# Altium schematic sheet mcu_imu.schdoc: MCU and IMU
size 431 x 279 mm; DrawnBy: D. Bruey, M.Ciuffo; Organization: Synapse Product Development, LLC.; Address1: 1511 6th Ave., Suite 400; Address2: Seattle, Washington 98101; Address3: 206.381.0898; Address4: www.synapse.com; DocumentNumber: 7; SheetNumber: 5; SheetTotal: 10; PageSetup: Record=PageOptions|CenterHorizontal=True|CenterVertical=True|PrintScale=0.96|XCorrection=1.00|YCorrection=1.00|PrintKind=1|BorderSize=5000000|LeftOffset=0|BottomOffset=0|Orientation=2|PaperLength=4318|PaperWidth=2794|Scale=100|PaperSource=7|PrintQuality=200|MediaType=1|DitherType=10|PrintScaleMode=1|PaperKind=11x17|PaperIndex=3
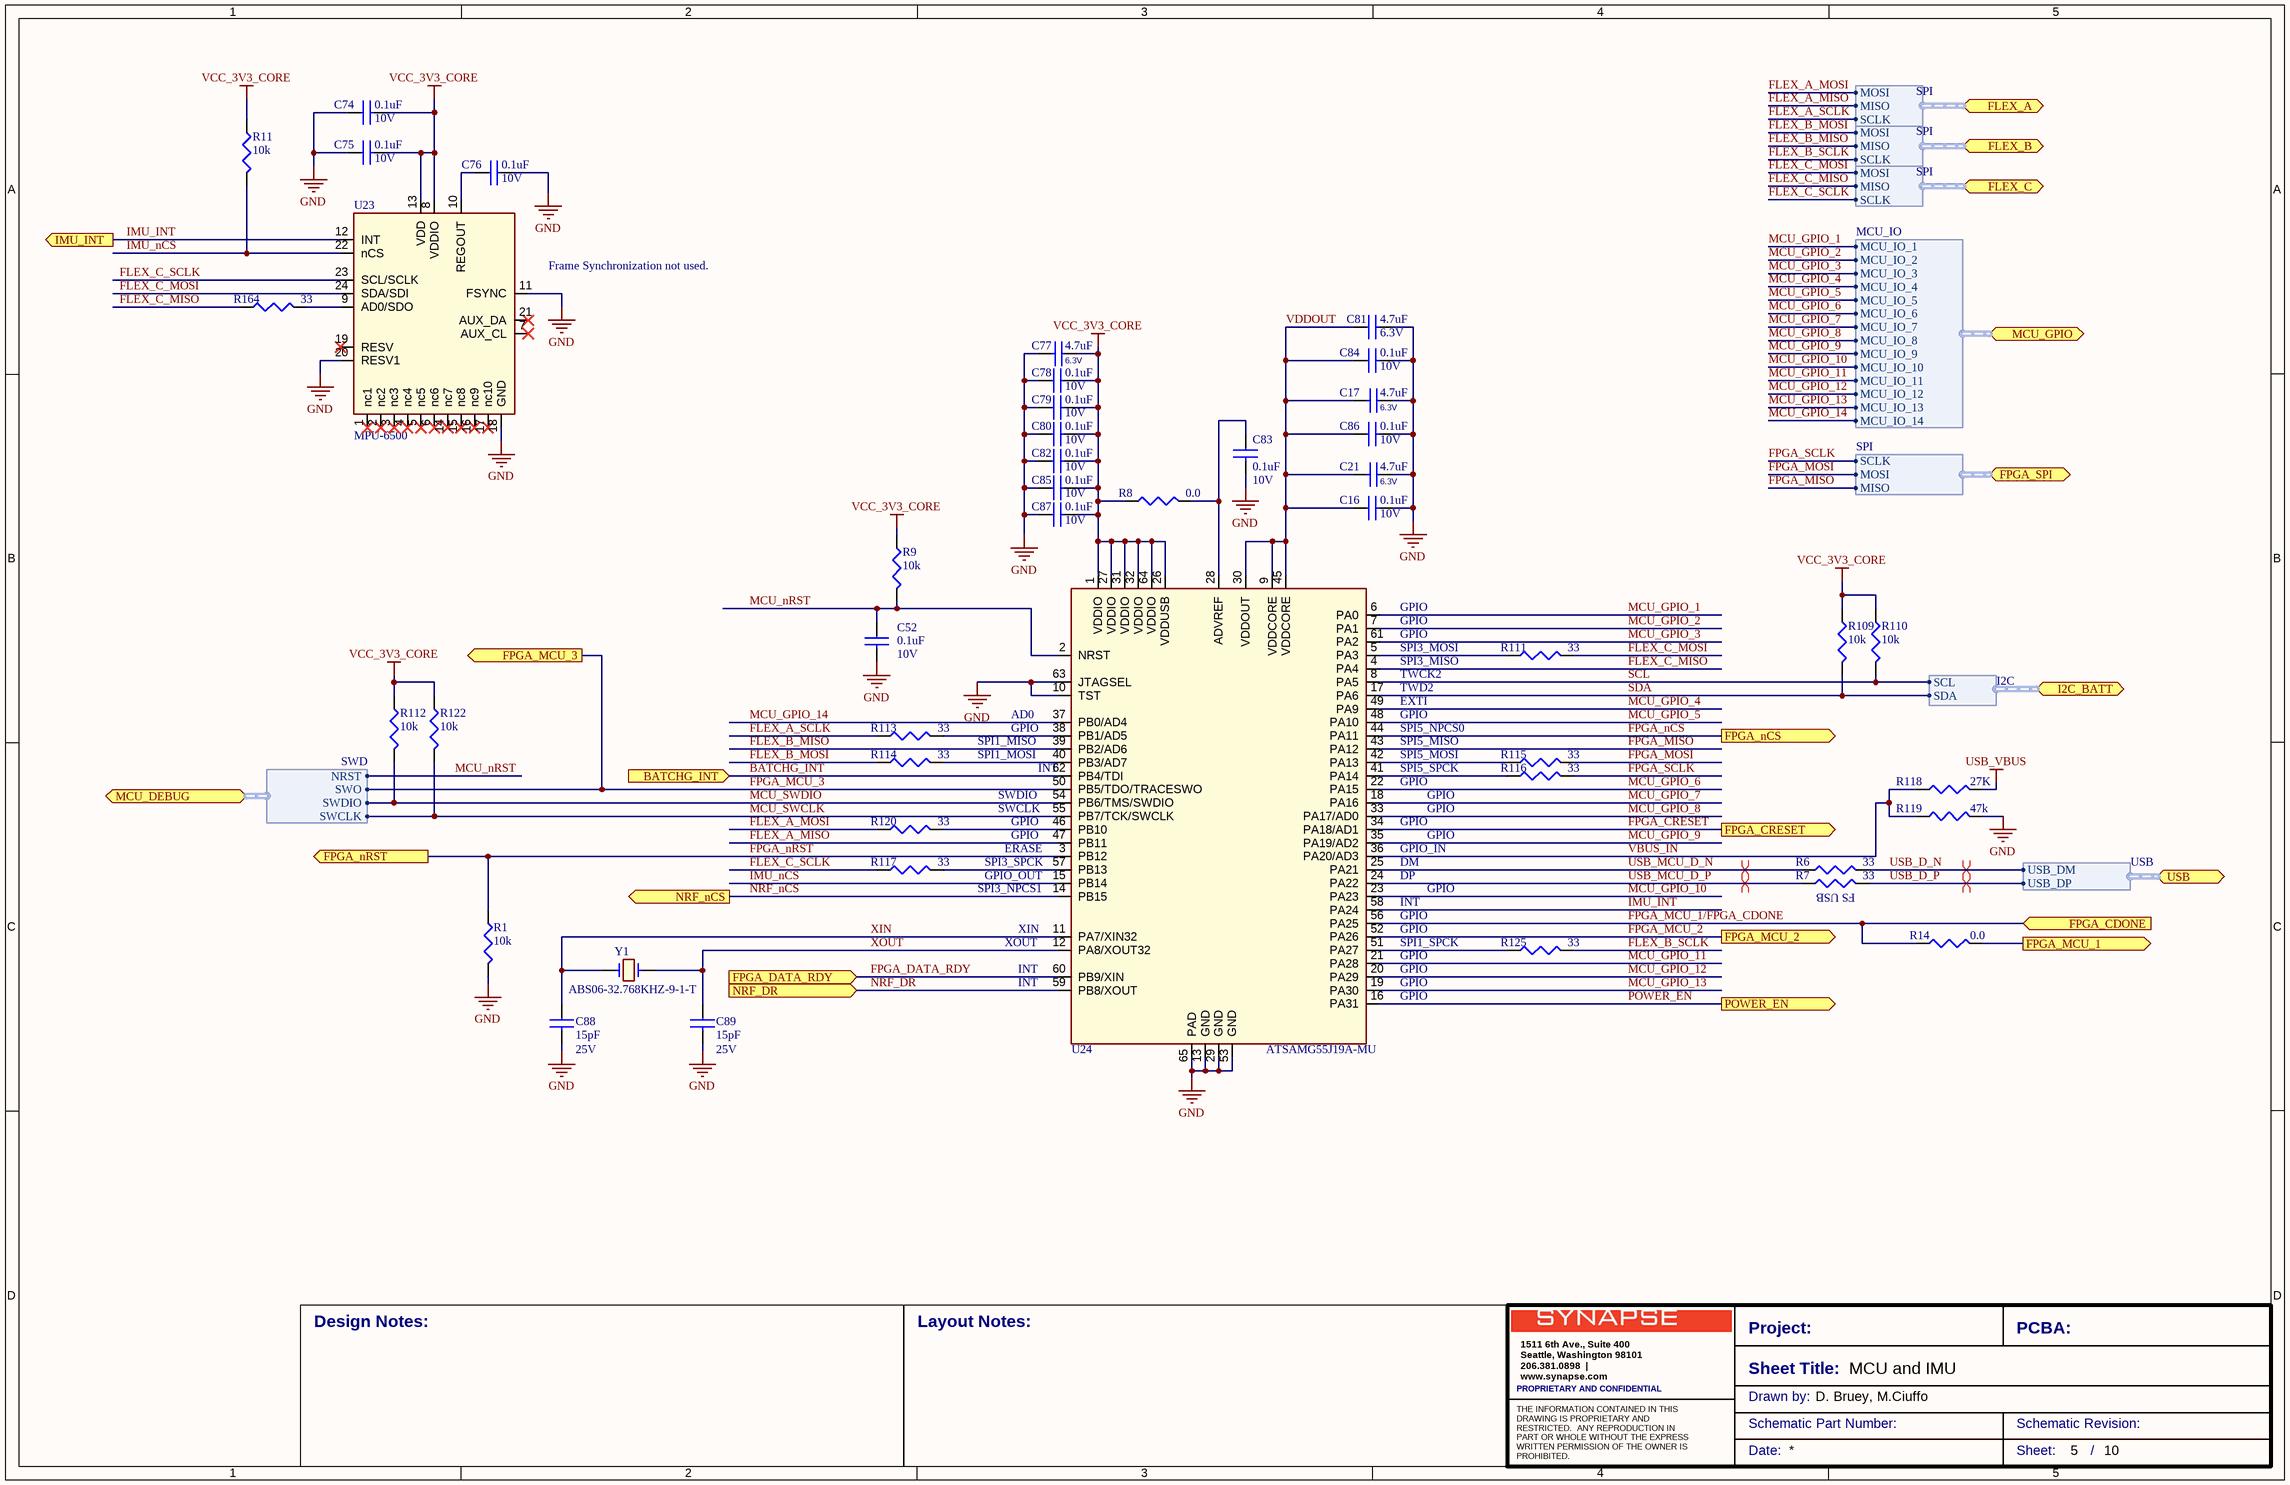
[diagram p0: mcu_imu.schdoc]

## Parts
C16  0.1uF  Voltage: 10V  [0201-IPCsm_33]
C17  4.7uF  Voltage: 6.3V  [0402-IPCsm_55]
C21  4.7uF  Voltage: 6.3V  [0402-IPCsm_55]
C52  0.1uF  Voltage: 10V  [0201-IPCsm_33]
C74  0.1uF  Voltage: 10V  [0201-IPCsm_33]
C75  0.1uF  Voltage: 10V  [0201-IPCsm_33]
C76  0.1uF  Voltage: 10V  [0201-IPCsm_33]
C77  4.7uF  Voltage: 6.3V  [0402-IPCsm_55]
C78  0.1uF  Voltage: 10V  [0201-IPCsm_33]
C79  0.1uF  Voltage: 10V  [0201-IPCsm_33]
C80  0.1uF  Voltage: 10V  [0201-IPCsm_33]
C81  4.7uF  Voltage: 6.3V  [0402-IPCsm_55]
C82  0.1uF  Voltage: 10V  [0201-IPCsm_33]
C83  0.1uF  Voltage: 10V  [0201-IPCsm_33]
C84  0.1uF  Voltage: 10V  [0201-IPCsm_33]
C85  0.1uF  Voltage: 10V  [0201-IPCsm_33]
C86  0.1uF  Voltage: 10V  [0201-IPCsm_33]
C87  0.1uF  Voltage: 10V  [0201-IPCsm_33]
C88  15pF  Voltage: 25V  [0201-IPCsm_33]
C89  15pF  Voltage: 25V  [0201-IPCsm_33]
R1  10k  [0201-IPCsm_26]
R6  33  [0201-IPCsm_26]
R7  33  [0201-IPCsm_26]
R8  0.0  [0201-IPCsm_26]
R9  10k  [0201-IPCsm_26]
R11  10k  [0201-IPCsm_26]
R14  0.0  [0201-IPCsm_26]
R109  10k  [0201-IPCsm_26]
R110  10k  [0201-IPCsm_26]
R111  33  [0201-IPCsm_26]
R112  10k  [0201-IPCsm_26]
R113  33  [0201-IPCsm_26]
R114  33  [0201-IPCsm_26]
R115  33  [0201-IPCsm_26]
R116  33  [0201-IPCsm_26]
R117  33  [0201-IPCsm_26]
R118  27K  [0201-IPCsm_26]
R119  47k  [0201-IPCsm_26]
R120  33  [0201-IPCsm_26]
R122  10k  [0201-IPCsm_26]
R125  33  [0201-IPCsm_26]
R164  33  [0201-IPCsm_26]
U23  MPU-6500  [QFN24_mpu-6500_3x3]
U24  ATSAMG55J19A-MU  [qfn64_atsamg55j19a_no_vias]
Y1  ABS06-32.768KHZ-9-1-T  [xtal_abs06]

## Ports
BATCHG_INT (in), FLEX_A (harness SPI), FLEX_B (harness SPI), FLEX_C (harness SPI), FPGA_CDONE (in), FPGA_CRESET (out), FPGA_DATA_RDY (in), FPGA_MCU_1 (out), FPGA_MCU_2 (out), FPGA_MCU_3 (out), FPGA_nCS (out), FPGA_nRST (out), FPGA_SPI (harness SPI), I2C_BATT (harness I2C), IMU_INT (out), MCU_DEBUG (harness SWD), MCU_GPIO (harness MCU_IO), NRF_DR (in), NRF_nCS (out), POWER_EN (out), USB (harness USB)

## Harnesses
SWD: NRST, SWCLK, SWDIO, SWO
USB: USB_DM, USB_DP
I2C: SDA, SCL
MCU_IO: MCU_IO_1, MCU_IO_2, MCU_IO_3, MCU_IO_4, MCU_IO_5, MCU_IO_6, MCU_IO_7, MCU_IO_8, MCU_IO_9, MCU_IO_10, MCU_IO_11, MCU_IO_12, MCU_IO_13, MCU_IO_14
SPI: MOSI, MISO, SCLK

## Nets
GND: C16.2 C17.1 C21.1 C52.2 C74.1 C75.1 C76.2 C77.2 C78.1 C79.1 C80.1 C81.2 C82.1 C83.2 C84.2 C85.1 C86.2 C87.1 C88.2 C89.2 R1.2 R119.2 U23.11(FSYNC) U23.18(GND) U23.20(RESV1) U24.10(TST) U24.13(GND) U24.29(GND) U24.53(GND) U24.63(JTAGSEL) U24.65(PAD)
USB_VBUS: R118.2
VCC_3V3_CORE: C74.2 C75.2 C77.1 C78.2 C79.2 C80.2 C82.2 C85.2 C87.2 R8.1 R9.1 R11.1 R109.1 R110.1 R112.1 R122.1 U23.8(VDDIO) U23.13(VDD) U24.1(VDDIO) U24.26(VDDUSB) U24.27(VDDIO) U24.31(VDDIO) U24.32(VDDIO) U24.64(VDDIO)
BATCHG_INT: U24.62(PB4/TDI) ; port BATCHG_INT
FLEX_A_MISO: U24.47(PB11) ; port FLEX_A.MISO
FLEX_A_MOSI: R120.1 ; port FLEX_A.MOSI
FLEX_A_SCLK: R113.1 ; port FLEX_A.SCLK
FLEX_B_MISO: U24.39(PB2/AD6) ; port FLEX_B.MISO
FLEX_B_MOSI: R114.1 ; port FLEX_B.MOSI
FLEX_B_SCLK: R125.2 ; port FLEX_B.SCLK
FLEX_C_MISO: R164.1 U24.4(PA4) ; port FLEX_C.MISO
FLEX_C_MOSI: R111.2 U23.24(SDA/SDI) ; port FLEX_C.MOSI
FLEX_C_SCLK: R117.1 U23.23(SCL/SCLK) ; port FLEX_C.SCLK
FPGA_CRESET: U24.34(PA18/AD1) ; port FPGA_CRESET
FPGA_DATA_RDY: U24.60(PB9/XIN) ; port FPGA_DATA_RDY
FPGA_MCU_1: R14.1 ; port FPGA_MCU_1
FPGA_MCU_1/FPGA_CDONE: R14.2 U24.56(PA25) ; port FPGA_CDONE
FPGA_MCU_2: U24.52(PA26) ; port FPGA_MCU_2
FPGA_MCU_3: U24.50(PB5/TDO/TRACESWO) ; port FPGA_MCU_3, port MCU_DEBUG.SWO
FPGA_MISO: U24.43(PA12) ; port FPGA_SPI.MISO
FPGA_MOSI: R115.2 ; port FPGA_SPI.MOSI
FPGA_nCS: U24.44(PA11) ; port FPGA_nCS
FPGA_nRST: R1.1 U24.3(PB12) ; port FPGA_nRST
FPGA_SCLK: R116.2 ; port FPGA_SPI.SCLK
IMU_INT: U23.12(INT) U24.58(PA24) ; port IMU_INT
IMU_nCS: R11.2 U23.22(nCS) U24.15(PB14)
MCU_GPIO_1: U24.6(PA0) ; port MCU_GPIO.MCU_IO_1
MCU_GPIO_2: U24.7(PA1) ; port MCU_GPIO.MCU_IO_2
MCU_GPIO_3: U24.61(PA2) ; port MCU_GPIO.MCU_IO_3
MCU_GPIO_4: U24.49(PA9) ; port MCU_GPIO.MCU_IO_4
MCU_GPIO_5: U24.48(PA10) ; port MCU_GPIO.MCU_IO_5
MCU_GPIO_6: U24.22(PA15) ; port MCU_GPIO.MCU_IO_6
MCU_GPIO_7: U24.18(PA16) ; port MCU_GPIO.MCU_IO_7
MCU_GPIO_8: U24.33(PA17/AD0) ; port MCU_GPIO.MCU_IO_8
MCU_GPIO_9: U24.35(PA19/AD2) ; port MCU_GPIO.MCU_IO_9
MCU_GPIO_10: U24.23(PA23) ; port MCU_GPIO.MCU_IO_10
MCU_GPIO_11: U24.21(PA28) ; port MCU_GPIO.MCU_IO_11
MCU_GPIO_12: U24.20(PA29) ; port MCU_GPIO.MCU_IO_12
MCU_GPIO_13: U24.19(PA30) ; port MCU_GPIO.MCU_IO_13
MCU_GPIO_14: U24.37(PB0/AD4) ; port MCU_GPIO.MCU_IO_14
MCU_nRST: C52.1 R9.2 U24.2(NRST) ; port MCU_DEBUG.NRST
MCU_SWCLK: R122.2 U24.55(PB7/TCK/SWCLK) ; port MCU_DEBUG.SWCLK
MCU_SWDIO: R112.2 U24.54(PB6/TMS/SWDIO) ; port MCU_DEBUG.SWDIO
NRF_DR: U24.59(PB8/XOUT) ; port NRF_DR
NRF_nCS: U24.14(PB15) ; port NRF_nCS
POWER_EN: U24.16(PA31) ; port POWER_EN
SCL: R110.2 U24.8(PA5) ; port I2C_BATT.SCL
SDA: R109.2 U24.17(PA6) ; port I2C_BATT.SDA
USB_D_N: R6.2 ; port USB.USB_DM
USB_D_P: R7.2 ; port USB.USB_DP
USB_MCU_D_N: R6.1 U24.25(PA21)
USB_MCU_D_P: R7.1 U24.24(PA22)
VBUS_IN: R118.1 R119.1 U24.36(PA20/AD3)
VDDOUT: C16.1 C17.2 C21.2 C81.1 C84.1 C86.1 U24.9(VDDCORE) U24.30(VDDOUT) U24.45(VDDCORE)
XIN: C88.1 U24.11(PA7/XIN32) Y1.1
XOUT: C89.1 U24.12(PA8/XOUT32) Y1.2
NetC76_1: C76.1 U23.10(REGOUT)
NetC83_1: C83.1 R8.2 U24.28(ADVREF)
NetR111_1: R111.1 U24.5(PA3)
NetR113_2: R113.2 U24.38(PB1/AD5)
NetR114_2: R114.2 U24.40(PB3/AD7)
NetR115_1: R115.1 U24.42(PA13)
NetR116_1: R116.1 U24.41(PA14)
NetR117_2: R117.2 U24.57(PB13)
NetR120_2: R120.2 U24.46(PB10)
NetR125_1: R125.1 U24.51(PA27)
NetR164_2: R164.2 U23.9(AD0/SDO)

Not connected (* = marked no-connect by the designer): U23 1(nc1)* 2(nc2)* 3(nc3)* 4(nc4)* 5(nc5)* 6(nc6)* 7(AUX_CL)* 14(nc7)* 15(nc8)* 16(nc9)* 17(nc10)* 19(RESV)* 21(AUX_DA)*

## Layout directives
differential pair: USB_D_N, USB_D_P, USB_MCU_D_N, USB_MCU_D_P

## Notes on the sheet
- (near U23) Frame Synchronization not used.
- (near U24) GPIO
- (near U24) TWD2
- (near U24) EXTI
- (near U24) TWCK2
- (near U24) SPI3_MISO
- (near U24) SPI3_MOSI
- SPI1_MISO
- SPI1_MOSI
- (near U24) AD0
- (near U24) SPI5_MISO
- (near U24) SPI5_MOSI
- (near U24) SPI5_NPCS0
- (near U24) SWDIO
- SWCLK
- (near U24) INT
- (near U24) SPI5_SPCK
- SPI3_NPCS1
- (near U24) SPI3_SPCK
- GPIO_OUT
- (near U24) ERASE
- (near U24) DM
- (near U24) DP
- (near U24) GPIO_IN
- (near R7) FS USB
- (near U24) XOUT
- (near U24) XIN
- (near U24) SPI1_SPCK
- Design Notes:
- Layout Notes:
- Project:
- Sheet Title:
- PCBA:
- PROPRIETARY AND CONFIDENTIAL
- Drawn by:
- Schematic Part Number:
- Schematic Revision:
- Date:
- Sheet:
- /

## Library data of the parts
C16 C52 C74-C76 C78-C80 C82-C87 = CL03A104KP3NNNC: CAP CER 0.1UF 10V 10% X5R 0201; part_type: capacitor; id: 1260; mfg: Samsung Electro-Mechanics America, Inc; dist: DIGIKEY; dist_pn: 1276-1115-2-ND; source_package: C_1U_10V_X5R_0201; TableName: viewAltiumCapacitors; mfg_pn: CL03A104KP3NNNC; type: X5R; tolerance: 10%; height: 0.33mm; status: Unknown
C17 C21 C77 = GRM155R60J475ME47D: CAP CER 4.7UF 6.3V 20% X5R 0402; part_type: capacitor; id: 855; mfg: MURATA; dist: DIGIKEY; dist_pn: 490-5915-1-ND; symbol: \\SYNAPSEDEV.COM\DFS\FS\EE_STUFF\CAD_LIB\MASTER\MASTER_DISCRETE\CAP; allegro_footprint: 0402-IPCsm_55,c-0402_22H; source_package: C_4P7U_6.3V_X5R_0402; OrCADSymbol: MASTER_DISCRETE\CAP; TableName: viewAltiumCapacitors; mfg_pn: GRM155R60J475ME47D; type: X5R; tolerance: 20%; height: 0.55MM; status: Unknown; SymbolPath: C:\EE-Vault\Libraries\Schematic\MASTER_DISCRETE\CAP
C81 = GRM155R60J475ME47D: CAP CER 4.7UF 6.3V 20% X5R 0402; part_type: capacitor; id: 855; mfg: MURATA; dist: DIGIKEY; dist_pn: 490-5915-1-ND; source_package: C_4P7U_6.3V_X5R_0402; TableName: viewAltiumCapacitors; mfg_pn: GRM155R60J475ME47D; type: X5R; tolerance: 20%; height: 0.55MM; status: Unknown
C88 C89 = GRM0335C1E150JA01D: CAP CER 15PF 25V C0G 0201; part_type: capacitor; id: 1280; mfg: Murata; dist: Digikey; dist_pn: 490-9658-1-ND; source_package: C_15p_25V_C0G_0201; type: C0G, NPO; tolerance: 5%; history: Created from GRM0335C1E150JD01D, 01-06-2016; where_used: MB2.1; TableName: viewAltiumCapacitors; mfg_pn: GRM0335C1E150JA01D; height: 0.33MM; status: Good
R1 R9 R11 R109 R110 R112 R122 = RC0201FR-0710KL: RES 10K OHM 1/20W 1% 0201 SMD; part_type: resistor; Tolerance: 1.00%; Voltage: 50V; DIST: DIGIKEY; MFG: YAGEO; DIST_PN: 311-10.0KMCT-ND; Power: 0.05W; id: 1527; source_package: R_10k_0201_1P; TableName: viewAltiumResistors; Height: .26MM; MFG_PN: RC0201FR-0710KL; status: Unknown
R6 R7 R111 R113-R117 R120 R125 R164 = RC0201FR-0733R: RES 33 OHM 1/20W 1% 0201 SMD; part_type: resistor; Tolerance: 1.00%; Voltage: 50V; DIST: DIGIKEY; MFG: YAGEO; DIST_PN: 311-33.0MCT-ND; Power: 0.05W; id: 1544; source_package: R_33_0201_1P; TableName: viewAltiumResistors; Height: .26MM; MFG_PN: RC0201FR-0733R; status: Unknown
R8 R14 = ERJ-1GE0R00C: RES SMD 0.0OHM JUMPER 1/20W 0201; part_type: resistor; DIST: Digikey; MFG: Panasonic; DIST_PN: P0.0AGCT-ND; Power: 0.05W; id: 2380; TableName: viewAltiumResistors; Height: 0.26MM; MFG_PN: ERJ-1GE0R00C; status: Unknown
R118 = ERJ-1GEF2702C: RES 27K OHM 1/20W 1% 0201 SMD; part_type: resistor; Tolerance: 1.00%; Voltage: 15V; DIST: Digikey; MFG: Panasonic; DIST_PN: P27.0KABCT-ND; Power: 0.05W; id: 2159; source_package: R_27K_1p_0201; TableName: viewAltiumResistors; Height: 0.26mm; MFG_PN: ERJ-1GEF2702C; status: Unknown
R119 = RC0201JR-0747KL: RES 47K OHM 1/20W 5% 0201 SMD; part_type: resistor; Tolerance: 5.00%; Voltage: 50V; DIST: DIGIKEY; MFG: YAGEO; DIST_PN: 311-47KNCT-ND; Power: 0.05W; id: 1523; source_package: R_47k_0201_5P; TableName: viewAltiumResistors; Height: .26MM; MFG_PN: RC0201JR-0747KL; status: Unknown
U23 = MPU-6500: 6-axis Gyroscope/Accelerometer; part_type: ic; id: 1823; mfg: InvenSense; symbol: \\SYNAPSEDEV.COM\DFS\FS\EE_STUFF\CAD_LIB\MASTER\MASTER_IC\MPU-6500a; allegro_footprint: qfn40p300x300x95-24s; OrCADSymbol: MASTER_IC\MPU-6500A; TableName: viewAltiumIcs; mfg_pn: MPU-6500; dist: InvenSense; dist_pn: MPU-6500; source_package: MPU-6500a; status: Unknown; SymbolPath: C:\EE-Vault\Libraries\Schematic\MASTER_IC\MPU-6500A
U24 = ATSAMG55J19A-MU: IC MCU 32BIT 512KB FLASH 64VQFN; id: 2421; mfg: Atmel; voltage: 1.62V~3.6V; TableName: viewAltiumIcs; mfg_pn: ATSAMG55J19A-MU; dist: ATMEL; dist_pn: ATSAMG55J19A-MU; part_type: ic; source_package: ATSAMG55J19A-MU; height: .85mm; status: Unknown; datasheet: http://www.atmel.com/Images/Atmel-11289-32-bit-Cortex-M4-Microcontroller-SAM-G55_Datasheet.pdf
Y1 = ABS06-32.768KHZ-9-1-T: CRYSTAL 32.768 KHZ 9PF SMD; id: 847; mfg: Abracon; dist: Digikey; dist_pn: 535-10247-1-ND; source_package: ABS06; tolerance: +/- 10ppm; TableName: viewAltiumMisc; mfg_pn: ABS06-32.768KHZ-9-1-T; part_type: crystal; height: 0.6mm; status: Unknown